# EAGLE schematic cameleonWand (EAGLE 6.0)
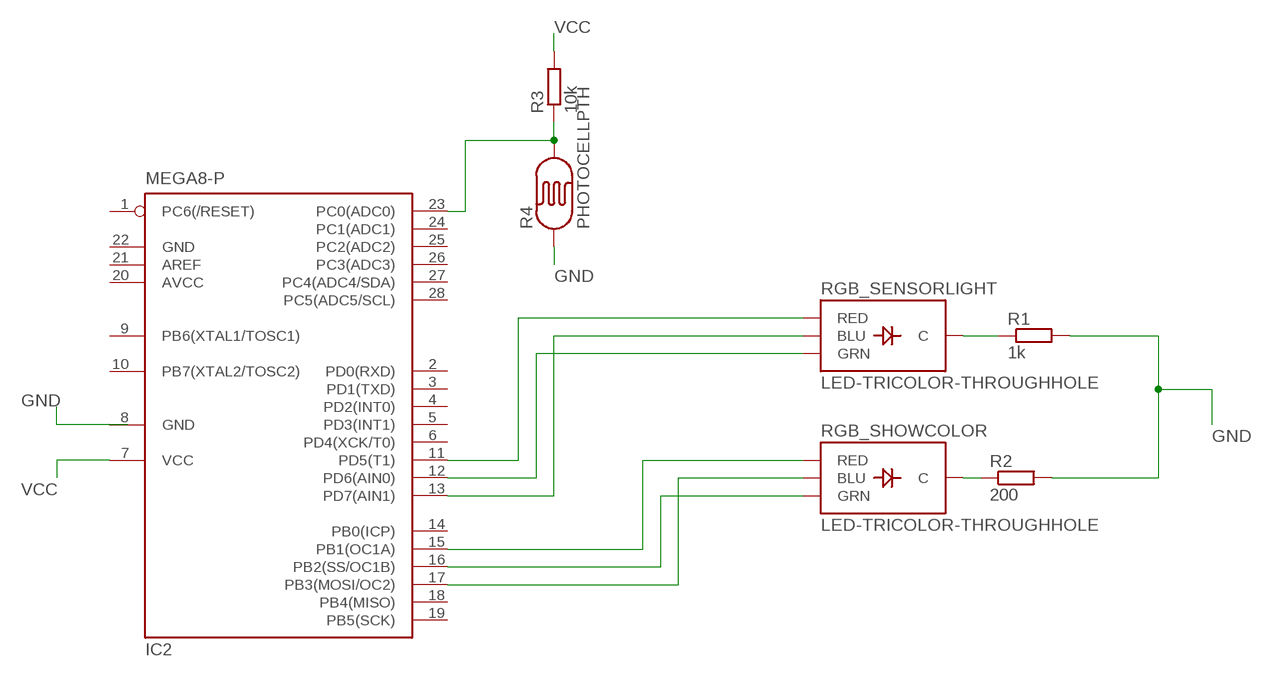
[diagram p0: schematic, sheet 1]

## Parts
IC2  MEGA8-P  [DIL28-3]
R1  1k  R-EU_0204/7  [0204/7]
R2  200  R-EU_0204/7  [0204/7]
R3  10k  R-EU_0204/7  [0204/7]
R4  PHOTOCELLPTH  [PHOTOCELL]
RGB_SENSORLIGHT  LED-TRICOLOR-THROUGHHOLE  [LED-TRICOLOR-THROUGHHOLE]
RGB_SHOWCOLOR  LED-TRICOLOR-THROUGHHOLE  [LED-TRICOLOR-THROUGHHOLE]

## Nets
GND: R1.2 R2.2 R4.1
N$1: IC2.23(PC0(ADC0)) R3.1 R4.2
N$2: R2.1 RGB_SHOWCOLOR.GND(C)
N$3: R1.1 RGB_SENSORLIGHT.GND(C)
N$4: IC2.15(PB1(OC1A)) RGB_SHOWCOLOR.RED
N$5: IC2.16(PB2(SS/OC1B)) RGB_SHOWCOLOR.GRN
N$6: IC2.17(PB3(MOSI/OC2)) RGB_SHOWCOLOR.BLU
N$7: IC2.11(PD5(T1)) RGB_SENSORLIGHT.RED
N$8: IC2.12(PD6(AIN0)) RGB_SENSORLIGHT.GRN
N$9: IC2.13(PD7(AIN1)) RGB_SENSORLIGHT.BLU
VCC: IC2.7(VCC) R3.2
Unconnected: IC2.1(PC6(/RESET)) IC2.2(PD0(RXD)) IC2.3(PD1(TXD)) IC2.4(PD2(INT0)) IC2.5(PD3(INT1)) IC2.6(PD4(XCK/T0)) IC2.9(PB6(XTAL1/TOSC1)) IC2.10(PB7(XTAL2/TOSC2)) IC2.14(PB0(ICP)) IC2.18(PB4(MISO)) IC2.19(PB5(SCK)) IC2.21(AREF) IC2.24(PC1(ADC1)) IC2.25(PC2(ADC2)) IC2.26(PC3(ADC3)) IC2.27(PC4(ADC4/SDA)) IC2.28(PC5(ADC5/SCL))

## Power pins joined to a net without a drawn wire
AVCC: IC2.20(AVCC)
GND: IC2.8(GND) IC2.22(GND)

## Library data of the parts
IC2 = atmel:MEGA8-P: MICROCONTROLLER 8 Kbytes FLASH, 1 kbytes SRAM, 512 bytes EEPROM, USART, 4-channel 10 bit ADC, 2-channel 8 bit ADC Pin compatible with Atmega48, ATMega88, ATMega168 Source: avr.lbr; OC_FARNELL: unknown; OC_NEWARK: unknown
R1-R3 = resistor:R-EU_: RESISTOR, European symbol
R4 = SparkFun:PHOTOCELL: Photocell Also known as a CdS photoresistor. This is a low cost way to detect light levels. Resistance decreases with more incoming light. SparkFun SKU: SEN-09088
RGB_SENSORLIGHT RGB_SHOWCOLOR = SparkFun:LED-TRICOLOR-THROUGHHOLE